# Altium schematic sheet BOPHATTINHIEU.SchDoc
size A; SheetNumber: 1; SheetTotal: 1
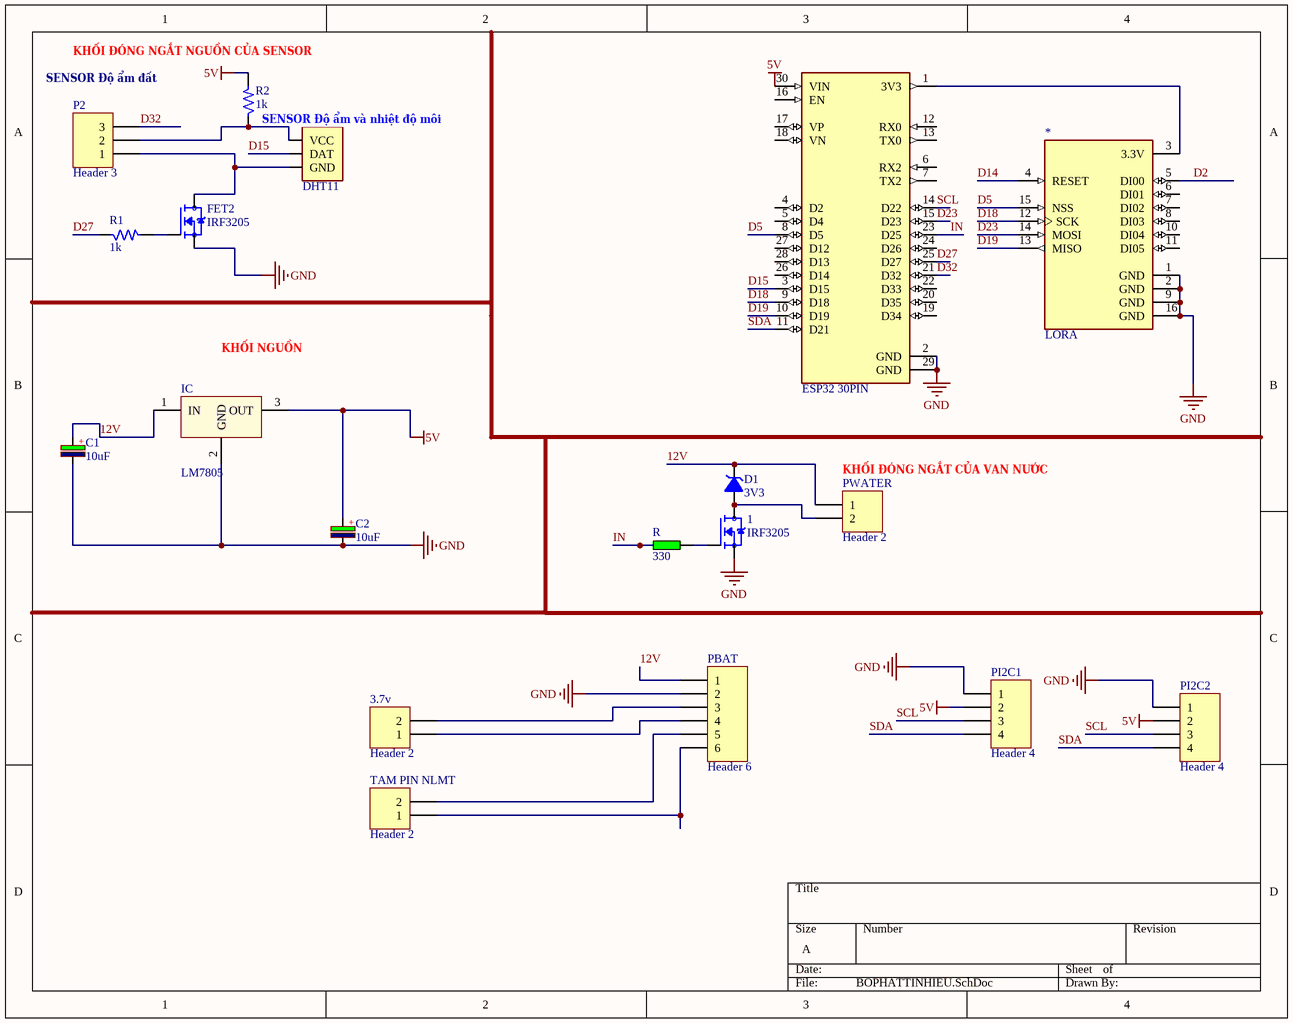
[diagram p0: BOPHATTINHIEU.SchDoc]

## Parts
(Parts that share a designator on the sheet are numbered #1, #2 ... from top to bottom, then left to right.)
1  IRF3205  [IRF3205]
3.7v  Header 2  [HDR1X2]
*#1  ESP32 30PIN  [ESP32 30P]
*#2  LORA  [LORA RA-02]
C1  10uF  [CP1/2]
C2  10uF  [CP1/2]
D1  3V3  [DZ0.5A]
DHT11  csa  [DHT11]  (value not drawn)
FET2  IRF3205  [IRF3205]
IC  LM7805  [QTO-220]
P2  Header 3  [HDR1X3]
PBAT  Header 6  [HDR1X6]
PI2C1  Header 4  [HDR1X4]
PI2C2  Header 4  [HDR1X4]
PWATER  Header 2  [HDR1X2]
R  330  [R1/4W]
R1  1k  [R1/4W]
R2  1k  [R1/4W]
TAM_PIN_NLMT  Header 2  [HDR1X2]

## Nets
5V: *#1.30(VIN) C2.1 IC.3(OUT) PI2C1.2 PI2C2.2 R2.2
GND: 1.3(S) *#1.2(GND) *#1.29(GND) *#2.1(GND) *#2.2(GND) *#2.9(GND) *#2.16(GND) C1.2 C2.2 FET2.3(S) IC.2(GND) PBAT.2 PI2C1.1 PI2C2.1
12V: C1.1 D1.2(K) IC.1(IN) PBAT.1 PWATER.1
D2: *#2.5(DI00)
D5: *#1.8(D5) *#2.15(NSS)
D14: *#2.4(RESET)
D15: *#1.3(D15) DHT11.P$2(DAT)
D18: *#1.9(D18) *#2.12(SCK)
D19: *#1.10(D19) *#2.13(MISO)
D23: *#1.15(D23) *#2.14(MOSI)
D27: *#1.25(D27) R1.1
D32: *#1.21(D32) P2.3
IN: *#1.23(D25) R.2
SCL: *#1.14(D22) PI2C1.3 PI2C2.3
SDA: *#1.11(D21) PI2C1.4 PI2C2.4
Net1_1: 1.1(G) R.1
Net1_2: 1.2(D) D1.1(A) PWATER.2
Net3.7v_1: 3.7v.1 PBAT.4
Net3.7v_2: 3.7v.2 PBAT.3
Net*#1_1: *#1.1(3V3) *#2.3(3.3V)
NetDHT11_P$1: DHT11.P$1(VCC) P2.2 R2.1
NetDHT11_P$4: DHT11.P$4(GND) FET2.2(D) P2.1
NetFET2_1: FET2.1(G) R1.2
NetPBAT_5: PBAT.5 TAM_PIN_NLMT.2
NetPBAT_6: PBAT.6 TAM_PIN_NLMT.1

Not connected (* = marked no-connect by the designer): *#1 4(D2) 5(D4) 6(RX2) 7(TX2) 12(RX0) 13(TX0) 16(EN) 17(VP) 18(VN) 19(D34) 20(D35) 22(D33) 24(D26) 26(D14) 27(D12) 28(D13); *#2 6(DI01) 7(DI02) 8(DI03) 10(DI04) 11(DI05)

## Notes on the sheet
- (near P2) SENSOR Độ ẩm đất
- (near R2) KHỐI ĐÓNG NGẮT NGUỒN CỦA SENSOR
- SENSOR Độ ẩm và nhiệt độ môi trường
- KHỐI NGUỒN
- (near PWATER) KHỐI ĐÓNG NGẮT CỦA VAN NƯỚC
- (in symbol CP0) +

## Library data of the parts
3.7v PWATER TAM_PIN_NLMT = Header 2: Header, 2-Pin; LatestRevisionDate: 17-Jul-2002; LatestRevisionNote: Re-released for DXP Platform.; Publisher: Altium Limited
*#2 = LORA: 433MHz
C1 C2 = CP0: Cap P  0,1uF < 22uF , 16 - 50V; Value: 10uF/50V; Description 1: 10 => 220uF/6,3V/10V - 10uF => 100uF/16V; Description 2: 0,1uF => 33uF/50V - 10uF => 22uF/63V; Description 3: 0,47uF => 10uF/100V
D1 = DZ: Diode Zenner; Value: 3v3
DHT11 = DHT11
IC = LM78xx: On ap +, from + 5 to + 24VDC; Value: LM7805
P2 = Header 3: Header, 3-Pin; LatestRevisionDate: 17-Jul-2002; LatestRevisionNote: Re-released for DXP Platform.; Publisher: Altium Limited
PBAT = Header 6: Header, 6-Pin; LatestRevisionDate: 17-Jul-2002; LatestRevisionNote: Re-released for DXP Platform.; Publisher: Altium Limited
PI2C1 PI2C2 = Header 4: Header, 4-Pin; LatestRevisionDate: 17-Jul-2002; LatestRevisionNote: Re-released for DXP Platform.; Publisher: Altium Limited
R = RES: Resistor 1/4W; Value: R1/4W - 1K
R1 R2 = R: Resistor 1/4W; Value: R1/4W - 1K